# EAGLE design BoardA1 (EAGLE 8.2.1)
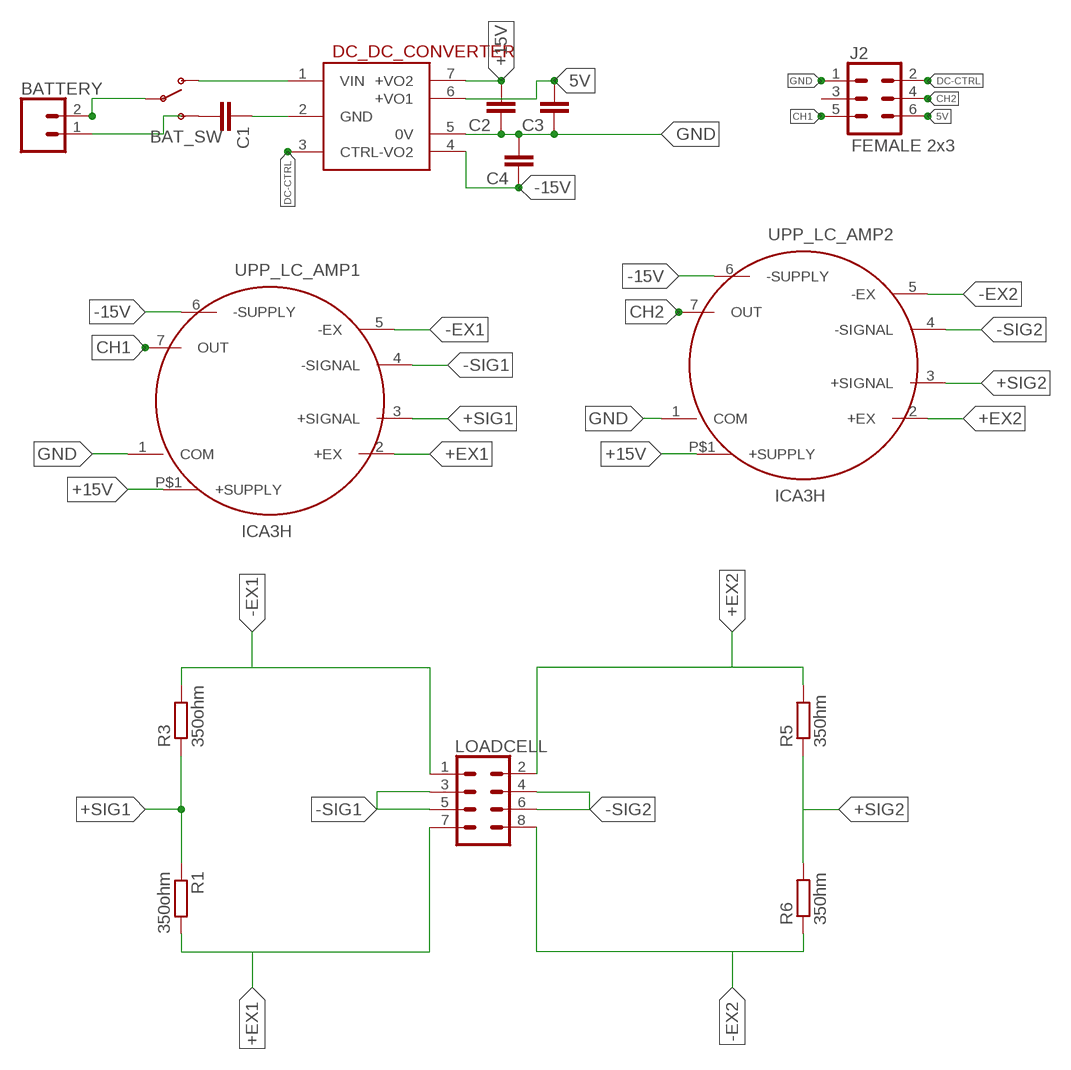
[diagram p0: schematic, sheet 1]

## Parts
BAT_SW  SWITCH-SPDTPTH  [SWITCH-SPDT]
BATTERY  CONN_02  [1X02]
C1  C2.5/2  [C2.5-2]
C2  C2.5/2  [C2.5-2]
C3  C2.5/2  [C2.5-2]
C4  C2.5/2  [C2.5-2]
DC_DC_CONVERTER  DC-DC  [DC-DCCONVERTER]
J2  FEMALE 2x3  CONN_03X2FEMALE  [2X3]
LOADCELL  CONN_04X2  [2X4]
R1  350ohm  R0207/10  [0207/10]
R3  350ohm  R0207/10  [0207/10]
R5  350hm  R0207/10  [0207/10]
R6  350hm  R0207/10  [0207/10]
UPP_LC_AMP1  ICA3H  [ICA3H]
UPP_LC_AMP2  ICA3H  [ICA3H]

## Nets
5V: C3.2 DC_DC_CONVERTER.6(+VO1) J2.6
+15V: C2.2 DC_DC_CONVERTER.7(+VO2) UPP_LC_AMP1.P$1(+SUPPLY) UPP_LC_AMP2.P$1(+SUPPLY)
+EX1: LOADCELL.7 R1.2 UPP_LC_AMP1.2(+EX)
+EX2: LOADCELL.2 R5.2 UPP_LC_AMP2.2(+EX)
+SIG1: R1.1 R3.1 UPP_LC_AMP1.3(+SIGNAL)
+SIG2: R5.1 R6.2 UPP_LC_AMP2.3(+SIGNAL)
-15V: C4.1 DC_DC_CONVERTER.4(-VO2) UPP_LC_AMP1.6(-SUPPLY) UPP_LC_AMP2.6(-SUPPLY)
-EX1: LOADCELL.1 R3.2 UPP_LC_AMP1.5(-EX)
-EX2: LOADCELL.8 R6.1 UPP_LC_AMP2.5(-EX)
-SIG1: LOADCELL.3 LOADCELL.5 UPP_LC_AMP1.4(-SIGNAL)
-SIG2: LOADCELL.4 LOADCELL.6 UPP_LC_AMP2.4(-SIGNAL)
CH1: J2.5 UPP_LC_AMP1.7(OUT)
CH2: J2.4 UPP_LC_AMP2.7(OUT)
DC-CTRL: DC_DC_CONVERTER.3(CTRL) J2.2
GND: C2.1 C3.1 C4.2 DC_DC_CONVERTER.5(0V) J2.1 UPP_LC_AMP1.1(COM) UPP_LC_AMP2.1(COM)
N$1: BATTERY.1
N$2: C1.1 DC_DC_CONVERTER.2(GND)
N$3: BAT_SW.1(O) DC_DC_CONVERTER.1(VIN)
N$5: BAT_SW.2(P) BATTERY.2
Unconnected: BAT_SW.3(S) C1.2 J2.3

## Library data of the parts
BAT_SW = SparkFun-Electromechanical:SWITCH-SPDT: SPDT Switch Simple slide switch, Spark Fun Electronics SKU : COM-00102 DPDT SMT slide switch, AYZ0202, SWCH-08179; PROD_ID: SWCH-08261
BATTERY = SparkFun-Connectors:CONN_02: Multi connection point. Often used as Generic Header-pin footprint for 0.1 inch spaced/style header connections On any of the 0.1 inch spaced packages, you can populate with these: Break Away Headers - Straight <https://www.sparkfun.com/products/116> (PRT-00116) Break Away Male Headers - Right Angle <https://www.sparkfun.com/products/553> (PRT-00553) Female Headers <https://www.sparkfun.com/products/115> (PRT-00115) Break Away Headers - Machine Pin <https://www.sparkfun.com/products/117> (PRT-00117) Break Away Female Headers - Swiss Machine Pin <https://www.sparkfun.com/products/743> (PRT-00743) For SCREWTERMINALS and SPRING TERMINALS visit here: Screw Terimnals on SparkFun.com <https://www.sparkfun.com/search/results?term=Screw+Terminals> (5mm/3.5mm/2.54mm spacing) This device is also useful as a general connection point to wire up your design to another part of your project. Our various solder wires solder well into these plated through hole pads. Hook-Up Wire - Assortment (Stranded, 22 AWG) <https://www.sparkfun.com/products/11375> (PRT-11375) Hook-Up Wire - Assortment (Solid Core, 22 AWG) <https://www.sparkfun.com/products/11367> (PRT-11367) View the entire wire category on our website here <https://www.sparkfun.com/categories/141> Special notes: Molex polarized connector foot print use with: PRT-08233 with associated crimp pins and housings. 2.54_SCREWTERM for use with PRT-10571. 3.5mm Screw Terminal footprints for PRT-08084 5mm Screw Terminal footprints for use with PRT-08432
C1-C4 = capacitor-wima:C: CAPACITOR naming: grid - package width
DC_DC_CONVERTER = Smartcrutches:DC-DC
J2 = SparkFun-Connectors:CONN_03X2: Multi connection point. Often used as Generic Header-pin footprint for 0.1 inch spaced/style header connections You can populate with any combo of single row headers, but if you'd like an exact match, check these: Header - 2x3 (Male, 0.1") <https://www.sparkfun.com/products/12807> (PRT-12807) Header - 2x3 (Female, 0.1") <https://www.sparkfun.com/products/13010> (PRT-13010) 2x3 Pin Shrouded Header <https://www.sparkfun.com/products/10877> (PRT-10877) On any of the 0.1 inch spaced packages, you can populate with these: Break Away Headers - Straight <https://www.sparkfun.com/products/116> (PRT-00116) Break Away Male Headers - Right Angle <https://www.sparkfun.com/products/553> (PRT-00553) Female Headers <https://www.sparkfun.com/products/115> (PRT-00115) Break Away Headers - Machine Pin <https://www.sparkfun.com/products/117> (PRT-00117) Break Away Female Headers - Swiss Machine Pin <https://www.sparkfun.com/products/743> (PRT-00743) Special note: the shrouded connector mates well with our 3x2 ribbon cables: Ribbon Crimp Connector - 6-pin (2x3, Female) <https://www.sparkfun.com/products/10651> (PRT-10651) Ribbon Cable - 6 wire (15ft) <https://www.sparkfun.com/products/10646> (PRT-10646); PROD_ID: CONN-11566
LOADCELL = SparkFun-Connectors:CONN_04X2: Multi connection point. Often used as Generic Header-pin footprint for 0.1 inch spaced/style header connections On any of the 0.1 inch spaced packages, you can populate with these: Break Away Headers - Straight <https://www.sparkfun.com/products/116> (PRT-00116) Break Away Male Headers - Right Angle <https://www.sparkfun.com/products/553> (PRT-00553) Female Headers <https://www.sparkfun.com/products/115> (PRT-00115) Break Away Headers - Machine Pin <https://www.sparkfun.com/products/117> (PRT-00117) Break Away Female Headers - Swiss Machine Pin <https://www.sparkfun.com/products/743> (PRT-00743)
R1 R3 R5 R6 = eagle-ltspice:R: RESISTOR, European symbol; SPICEMODEL: NONE; SPICEPREFIX: R
UPP_LC_AMP1 UPP_LC_AMP2 = Smartcrutches:ICA3H

## Board
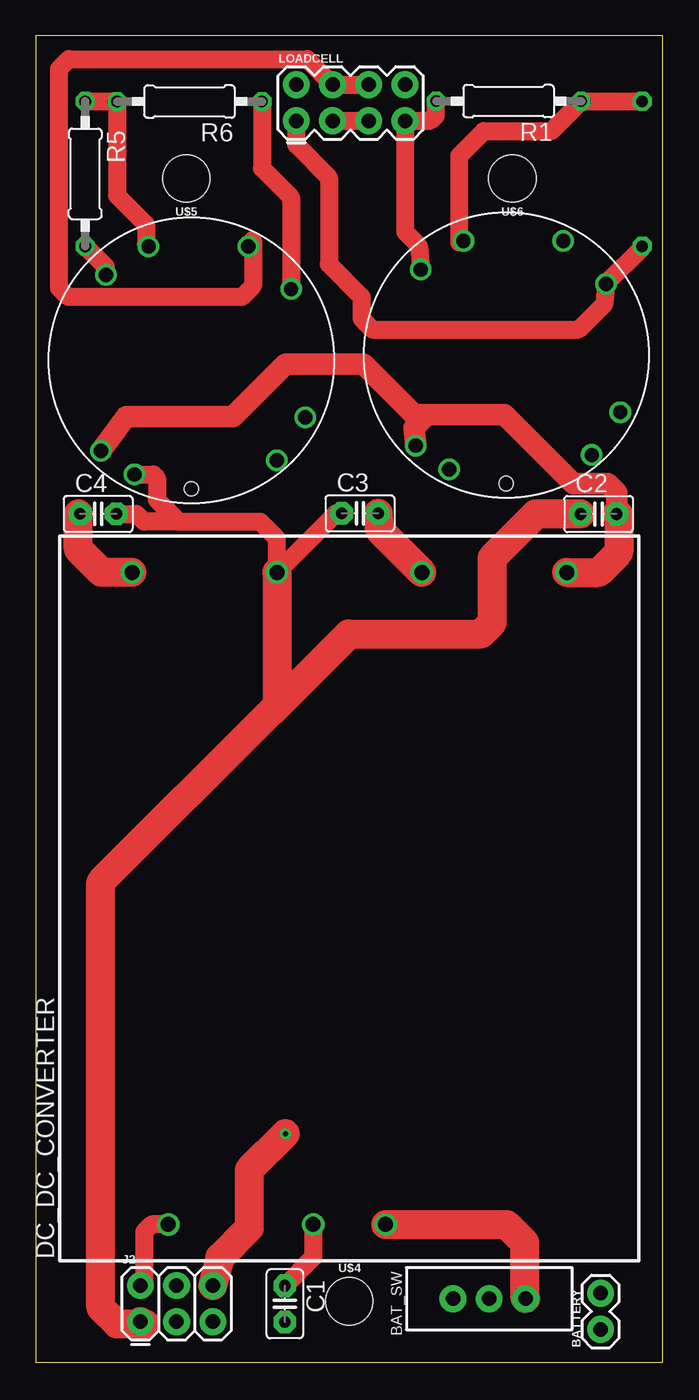
[diagram p1: board, top side]
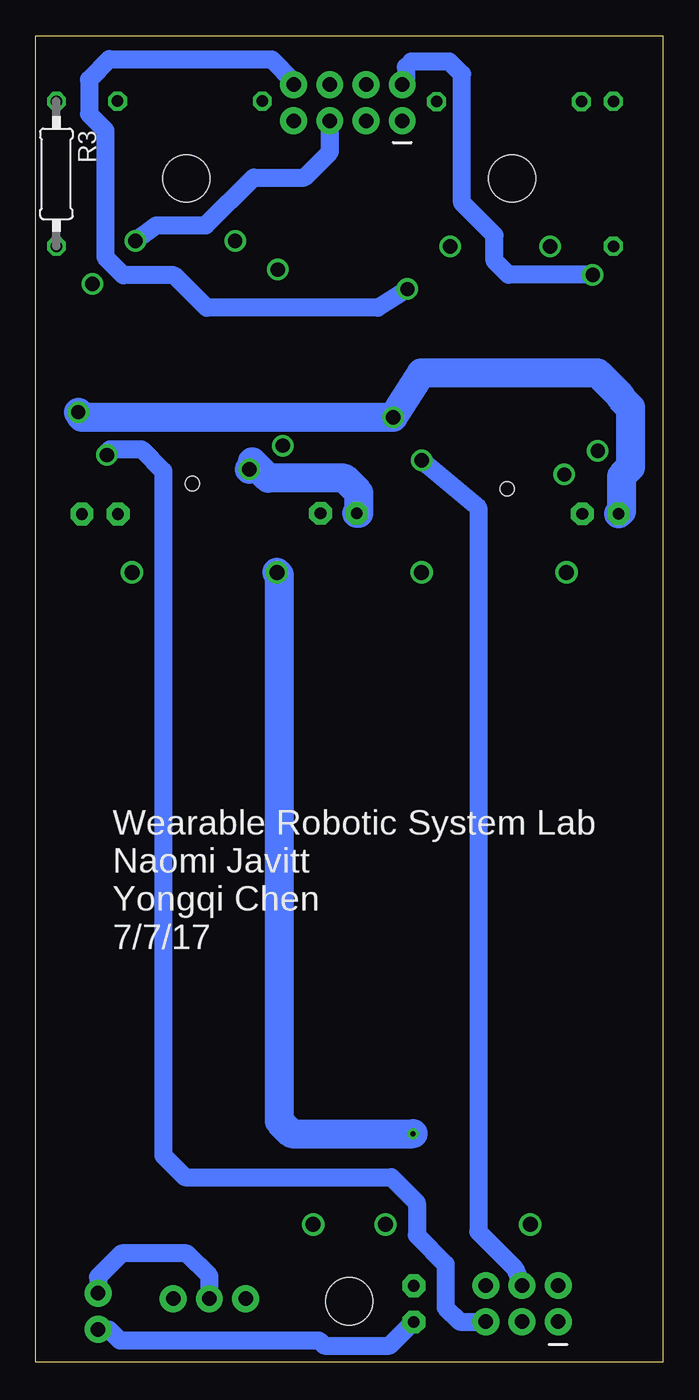
[diagram p2: board, bottom side, seen from below]

Size 44 x 93 mm. Coordinates in mm from the lower left corner, seen from the top.
Outline: 0,0 44,0 44,93 0,93 0,0
Copper layers (1*16): Top 0.035mm / dielectric 1.5mm / Bottom 0.035mm
Design rules "pentalogix": minimum track width 5mil, minimum drill 8mil, track to track 5mil, track to pad 5mil, pad to pad 5mil, via to via 5mil, smd to smd 5mil, copper to edge 12mil, drill to drill 6mil, minimum pad ring 10mil, minimum via ring 8mil, stop-mask expansion 4mil, vias tented up to drill 0mil, thermal gap 10mil

### Footprints (pad centres in the part's own frame; a part is rotated, then mirrored left to right if it is on the bottom)
SWITCH-SPDT = drill 1.016 pad 1.88: 1 0,2.54; 2 0,0; 3 0,-2.54
1X02 = drill 1.016 pad 1.88: 1 0,0; 2 2.54,0
C2.5-2 = drill 0.813 pad 1.6 octagon: 1 -1.27,0; 2 1.27,0
DC-DCCONVERTER = drill 1.05: 1 -22.86,-12.7; 2 -22.86,-7.62; 3 -22.86,2.54; 4 22.86,5.08; 5 22.86,-5.08; 6 22.86,-15.24; 7 22.86,-25.4
2X3 = drill 1.016 pad 1.88: 1 0,0; 2 0,2.54; 3 2.54,0; 4 2.54,2.54; 5 5.08,0; 6 5.08,2.54
2X4 = drill 1.016 pad 1.88: 1 -3.81,-1.27; 2 -3.81,1.27; 3 -1.27,-1.27; 4 -1.27,1.27; 5 1.27,-1.27; 6 1.27,1.27; 7 3.81,-1.27; 8 3.81,1.27
0207/10 = drill 0.813 octagon: 1 -5.08,0; 2 5.08,0
STAND-OFF = hole 3.302: 0,0
ICA3H = drill 1: 1 8,-4; 2 -6,-6; 3 -8,-3; 4 -8,4; 5 -5,7; 6 4,8; 7 7,6; P$1 6.35,-6.35 | hole 1: 9,0

### Placement (x,y rotation side)
BAT_SW  31.81,4.45 270 top
BATTERY  39.62,2.29 90 top
C1  17.48,4.08 270 top
C2  39.49,59.46 0 top
C3  22.75,59.51 0 top
C4  4.38,59.47 0 top
DC_DC_CONVERTER  11.84,32.51 90 top
J2  7.35,2.83 0 top
LOADCELL  22.1,88.3 0 top
R1  33.18,88.41 180 top
R3  42.55,83.31 270 bottom
R5  3.48,83.31 270 top
R6  10.8,88.38 180 top
U$4  [STAND-OFF]  22.01,4.26 0 top
U$5  [STAND-OFF]  10.58,83 180 top
U$6  [STAND-OFF]  33.44,83 180 top
UPP_LC_AMP1  33.01,70.6 270 top
UPP_LC_AMP2  10.92,70.23 270 top

### Tracks (layer width: path | path; a pad name or v marks a point on that pad's centre or on a via)
5V  (via drill 0.35)
  Top 2.032: DC_DC_CONVERTER.6 24.14,58.31 C3.2 | v17.53,16 14.99,13.46 14.99,9.4 12.94,7.35 J2.6
  Bottom 2.032: DC_DC_CONVERTER.6 26.92,55.21 26.92,16.89 26.04,16 v17.53,16
+15V
  Top 1.524: UPP_LC_AMP2.P$1 6.35,66.29 13.84,66.29 17.53,69.98 22.99,69.98 26.53,66.43 27.43,66.43 | UPP_LC_AMP1.P$1 26.53,65.53 27.43,66.43 | 27.43,66.43 32.88,66.43 37.72,61.59 40.13,61.59 40.77,60.96 40.77,59.58 40.89,59.45
  Top 2.032: DC_DC_CONVERTER.7 39.5,55.37 40.89,56.77 40.89,59.45 C2.2
+EX1
  Top 1.27: UPP_LC_AMP1.2 26.88,78.27 25.91,79.25 LOADCELL.7 27.59,87.03 27.69,87.12 27.81,87.12 28.07,87.38 28.07,88.38 R1.2
+EX2
  Top 1.27: UPP_LC_AMP2.2 4.92,76.79 R5.2
  Bottom 1.27: UPP_LC_AMP2.2 10.83,76.23 11.81,77.22 11.81,78.99 12.06,79.25 14.1,81.28 14.1,90.3 14.99,91.19 17.65,91.19 18.03,90.81 18.03,89.82 LOADCELL.2
+SIG1
  Top 1.27: UPP_LC_AMP1.3 29.72,78.51 29.72,84.58 31.44,86.3 36.18,86.3 38.27,88.39 R1.1 42.53,88.41 R3.1
+SIG2
  Top 1.27: R5.1 5.7,88.39 R6.2 5.71,81.79 7.75,79.76 7.75,78.41 UPP_LC_AMP2.3
-15V
  Top 1.27: 3,59.46 C4.1
  Top 2.032: DC_DC_CONVERTER.4 4.63,55.37 3,57 3,59.46
  Bottom 2.032: C4.1 2.92,59.66 2.92,62.1 2.29,62.74 2.29,66.93 2.99,67.63 2.99,67.76 4.57,69.34 16.95,69.34 UPP_LC_AMP2.6 40.77,66.23 UPP_LC_AMP1.6
-EX1
  Top 1.27: LOADCELL.1 18.29,85.35 20.57,83.06 20.57,76.96 22.86,74.68 22.86,73.15 23.62,72.39 38.1,72.39 39.88,74.17 UPP_LC_AMP1.5 | UPP_LC_AMP1.5 39.88,75.57 | R3.2 42.55,78.14 UPP_LC_AMP1.5
-EX2
  Top 1.27: UPP_LC_AMP2.5 17.91,75.25 17.91,81.66 15.88,83.69 R6.1
  Bottom 1.27: UPP_LC_AMP2.5 20,73.91 32,73.91 34.29,76.2 37.85,76.2 39.12,77.47 39.12,86.36 40.26,87.5 40.26,89.92 38.83,91.35 38.79,91.31 27.43,91.31 25.91,89.79 LOADCELL.8
-SIG1
  Top 1.27: LOADCELL.3 LOADCELL.5
  Bottom 1.27: UPP_LC_AMP1.4 35.53,79.7 32.07,79.7 28.71,83.06 25.15,83.06 23.37,84.84 LOADCELL.5
-SIG2
  Top 1.27: LOADCELL.6 LOADCELL.4 19.05,91.35 2.32,91.35 1.65,90.68 1.65,75.31 2.29,74.68 14.48,74.68 15.24,75.44 15.24,78.67 UPP_LC_AMP2.4
CH1
  Bottom 1.27: UPP_LC_AMP1.7 38.78,64.01 36.58,64.01 35.05,62.48 35.05,14.48 33.53,12.95 19.05,12.95 17.27,11.18 17.27,8.89 15.24,6.86 15.24,3.81 14.26,2.83 J2.5
CH2
  Bottom 1.27: UPP_LC_AMP2.7 12.95,59.9 12.95,9.14 10.39,6.58 J2.4
DC-CTRL
  Top 1.27: DC_DC_CONVERTER.3 8.13,9.65 7.62,9.14 7.62,5.6 J2.2
GND
  Top 1.27: C4.2 7.08,59.47 7.62,58.93 10.03,58.93 | 10.03,58.93 15.75,58.93 16.89,57.78 16.89,55.4 DC_DC_CONVERTER.5 21.06,59.51 C3.1 | UPP_LC_AMP2.1 8.25,62.23 8.51,61.98 8.51,60.45 10.03,58.93
  Top 2.032: J2.1 7.7,2.67 5.71,2.67 4.57,3.81 4.57,33.66 16.51,45.59 | C2.1 35.08,59.46 32,56.39 32,51.82 31.24,51.05 21.97,51.05 16.51,45.59 | DC_DC_CONVERTER.5 16.92,46.01 16.51,45.59
  Bottom 2.032: C3.1 21.34,59.52 21.34,60.96 22.35,61.98 27.69,61.98 28.82,63.11 UPP_LC_AMP1.1
N$1
  Bottom 1.27: BATTERY.1 38.86,2.29 38.1,1.52 24.13,1.52 23.75,1.14 19.18,1.14 17.53,2.79
N$2
  Top 1.27: DC_DC_CONVERTER.2 19.46,7.33 C1.1
N$3
  Top 2.032: DC_DC_CONVERTER.1 33.02,9.65 34.29,8.38 34.29,4.63 BAT_SW.1
N$5
  Bottom 1.27: BAT_SW.2 31.81,6.03 33.4,7.62 37.97,7.62 39.62,5.97 BATTERY.2

### Text on the board
_bsilk: Wearable Robotic System Lab / Naomi Javitt / Yongqi Chen / 7/7/17